# Altium schematic sheet 2020-04-02-04-30101 - ETC_Interface_Circuit_1.SchDoc
size A4
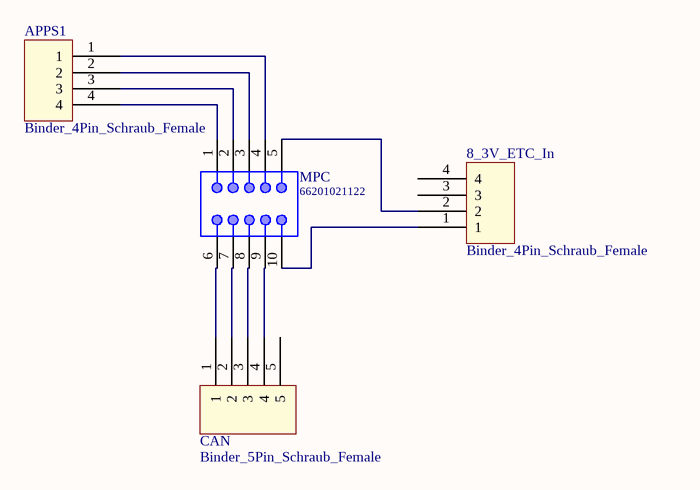
[diagram p0: 2020-04-02-04-30101 - ETC_Interface_Circuit_1.SchDoc]

## Parts
8_3V_ETC_In  Binder_4Pin_Schraub_Female  [09 0412 30 04]
APPS1  Binder_4Pin_Schraub_Female  [09 0412 30 04]
CAN  Binder_5Pin_Schraub_Female  [09 0416 30 05]
MPC  66201021122  [66201021122]

## Nets
Net8_3V_ETC_In_1: 8_3V_ETC_In.1 MPC.10
Net8_3V_ETC_In_2: 8_3V_ETC_In.2 MPC.5
NetAPPS1_1: APPS1.1 MPC.4
NetAPPS1_2: APPS1.2 MPC.3
NetAPPS1_3: APPS1.3 MPC.2
NetAPPS1_4: APPS1.4 MPC.1
NetCAN_1: CAN.1 MPC.6
NetCAN_2: CAN.2 MPC.7
NetCAN_3: CAN.3 MPC.8
NetCAN_4: CAN.4 MPC.9

Not connected (* = marked no-connect by the designer): 8_3V_ETC_In 3 4; CAN 5

## Library data of the parts
MPC = 66201021122: THT Male Header WR-MPC3, Vertical, Dual Row, pitch 3 mm, 10 pins; Pitch: 3 mm; Working Voltage: 250 VAC; Contact Resistance: 10 mOhm; Pin Number: 10; ComponentLink1Description: Manufacturer; ComponentLink1URL: http://www.we-online.de; ComponentLink2Description: Datasheet; ComponentLink2URL: https://katalog.we-online.de/em/datasheet/6620xx21122.pdf; Part Number: 66201021122; Published Date: September 2018; Publisher: Wurth Elektronik; Operating Temperature: -40 to 105 degC; Packaging: Tube; Gender: Male; Mounting Technology: THT; Orientation: Vertical